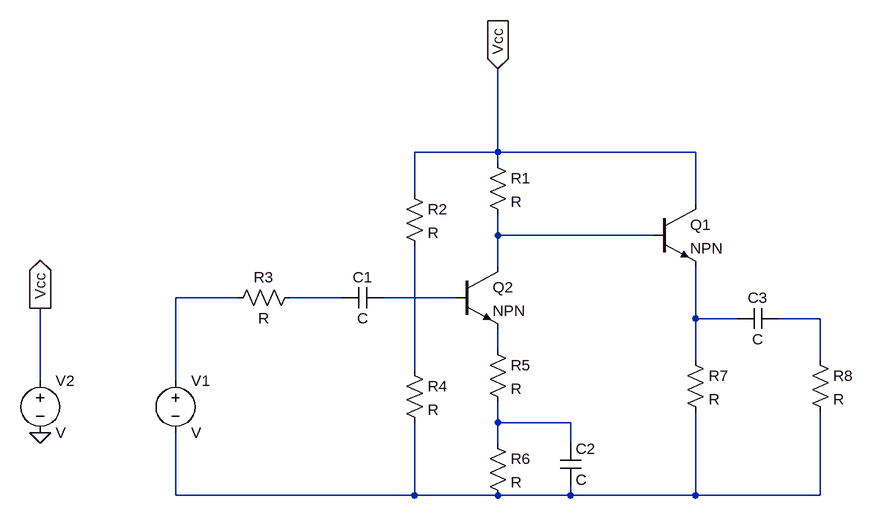
[diagram p0: schematic lab1.asc]
lab1.asc, the LTspice schematic file:
Version 4
SHEET 1 880 680
WIRE 80 -240 80 -368
WIRE 80 -240 -48 -240
WIRE 384 -240 80 -240
WIRE 80 -224 80 -240
WIRE -48 -176 -48 -240
WIRE 384 -160 384 -240
WIRE 80 -112 80 -144
WIRE 320 -112 80 -112
WIRE 80 -64 80 -112
WIRE -320 -16 -416 -16
WIRE -160 -16 -240 -16
WIRE 16 -16 -96 -16
WIRE 384 16 384 -64
WIRE 448 16 384 16
WIRE 576 16 512 16
WIRE 80 64 80 32
WIRE 384 80 384 16
WIRE 576 80 576 16
WIRE -48 96 -48 -96
WIRE -624 112 -624 0
WIRE -416 112 -416 -16
WIRE 80 176 80 144
WIRE 192 176 80 176
WIRE 80 208 80 176
WIRE 192 208 192 176
WIRE -416 288 -416 192
WIRE -48 288 -48 176
WIRE -48 288 -416 288
WIRE 80 288 -48 288
WIRE 192 288 192 272
WIRE 192 288 80 288
WIRE 384 288 384 160
WIRE 384 288 192 288
WIRE 576 288 576 160
WIRE 576 288 384 288
FLAG 80 -368 Vcc
IOPIN 80 -368 In
FLAG -624 192 0
FLAG -624 0 Vcc
IOPIN -624 0 Out
SYMBOL npn 320 -160 R0
SYMATTR InstName Q1
SYMBOL npn 16 -64 R0
SYMATTR InstName Q2
SYMBOL res 64 -240 R0
SYMATTR InstName R1
SYMBOL res -64 -192 R0
SYMATTR InstName R2
SYMBOL cap -96 -32 R90
WINDOW 0 0 32 VBottom 2
WINDOW 3 32 32 VTop 2
SYMATTR InstName C1
SYMBOL res -224 -32 R90
WINDOW 0 0 56 VBottom 2
WINDOW 3 32 56 VTop 2
SYMATTR InstName R3
SYMBOL voltage -416 96 R0
SYMATTR InstName V1
SYMBOL res -64 80 R0
SYMATTR InstName R4
SYMBOL res 64 48 R0
SYMATTR InstName R5
SYMBOL res 64 192 R0
SYMATTR InstName R6
SYMBOL cap 176 208 R0
SYMATTR InstName C2
SYMBOL res 368 64 R0
SYMATTR InstName R7
SYMBOL cap 512 0 R90
WINDOW 0 0 32 VBottom 2
WINDOW 3 32 32 VTop 2
SYMATTR InstName C3
SYMBOL res 560 64 R0
SYMATTR InstName R8
SYMBOL voltage -624 96 R0
SYMATTR InstName V2

The netlist it stands for:
* lab1.asc
Q1 Vcc N001 N005 0 NPN
Q2 N001 N004 N007 0 NPN
R1 Vcc N001 R
R2 Vcc N008 R
C1 N004 N003 C
R3 N003 N002 R
V1 N002 N010 V
R4 N008 N010 R
R5 N007 N009 R
R6 N009 N010 R
C2 N009 N010 C
R7 N005 N010 R
C3 N006 N005 C
R8 N006 N010 R
V2 Vcc 0 V
.model NPN NPN
.model PNP PNP
.lib standard.bjt
.backanno
.end